# Altium schematic sheet Controler.SchDoc
size 203 x 177 mm
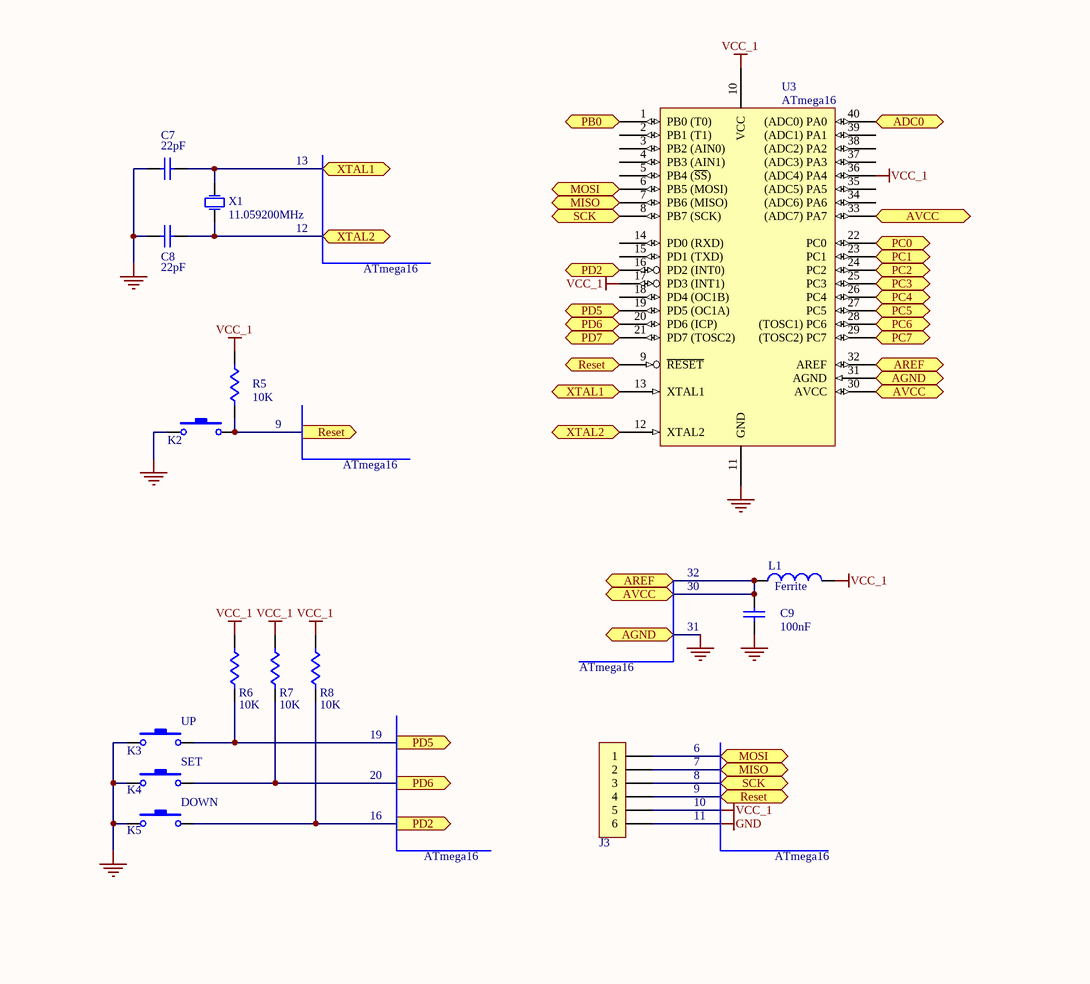
[diagram p0: Controler.SchDoc]

## Parts
C7  value 22pF  [RAD_5.08MM]  (hidden comment: Capacitor_2)
C8  value 22pF  [RAD_5.08MM]  (hidden comment: Capacitor_2)
C9  value 100nF  [RAD_5.08MM]  (hidden comment: Capacitor_2)
J3  Connector_6pin  [HDR1X6]  (value not drawn)
K2  SW-PB  [SPST-2]  (value not drawn)
K3  SW-PB  [SPST-2]  (value not drawn)
K4  SW-PB  [SPST-2]  (value not drawn)
K5  SW-PB  [SPST-2]  (value not drawn)
L1  Ferrite  [Inductor_1]
R5  value 10K  [AXIAL0.4]  (hidden comment: Resistor)
R6  value 10K  [AXIAL0.4]  (hidden comment: Resistor)
R7  value 10K  [AXIAL0.4]  (hidden comment: Resistor)
R8  value 10K  [AXIAL0.4]  (hidden comment: Resistor)
U3  Device: ATmega16  [DIP-40]  (hidden comment: ATmega16_DIP40)
X1  value 11.059200MHz  [XTAL_1]  (hidden comment: XTAL)

## Ports
ADC0, AGND, AREF, AVCC, MISO, MOSI, PB0, PC0, PC1, PC2, PC3, PC4, PC5, PC6, PC7, PD2, PD2 (out), PD5, PD5 (out), PD6, PD6 (out), PD7, Reset, Reset (out), SCK, XTAL1, XTAL2

## Nets
GND: C7.1 C8.1 C9.1 J3.6 K2.1 K3.1 K4.1 K5.1 U3.11(GND) U3.31(AGND) ; port AGND
VCC_1: J3.5 L1.2 R5.1 R6.1 R7.1 R8.1 U3.10(VCC) U3.17(PD3_(INT1)) U3.36((ADC4)_PA4)
ADC0: U3.40((ADC0)_PA0) ; port ADC0
AREF: C9.2 L1.1 U3.30(AVCC) U3.32(AREF) U3.33((ADC7)_PA7) ; port AREF, port AVCC
MISO: J3.2 U3.7(PB6_(MISO)) ; port MISO
MOSI: J3.1 U3.6(PB5_(MOSI)) ; port MOSI
PB0: U3.1(PB0_(T0)) ; port PB0
PC0: U3.22(PC0) ; port PC0
PC1: U3.23(PC1) ; port PC1
PC2: U3.24(PC2) ; port PC2
PC3: U3.25(PC3) ; port PC3
PC4: U3.26(PC4) ; port PC4
PC5: U3.27(PC5) ; port PC5
PC6: U3.28((TOSC1)_PC6) ; port PC6
PC7: U3.29((TOSC2)_PC7) ; port PC7
PD2: K5.2 R8.2 U3.16(PD2_(INT0)) ; port PD2
PD5: K3.2 R6.2 U3.19(PD5_(OC1A)) ; port PD5
PD6: K4.2 R7.2 U3.20(PD6_(ICP)) ; port PD6
PD7: U3.21(PD7_(TOSC2)) ; port PD7
Reset: J3.4 K2.2 R5.2 U3.9(~{RESET}) ; port Reset
SCK: J3.3 U3.8(PB7_(SCK)) ; port SCK
XTAL1: C7.2 U3.13(XTAL1) X1.2(OSC2) ; port XTAL1
XTAL2: C8.2 U3.12(XTAL2) X1.1(OSC1) ; port XTAL2

Not connected (* = marked no-connect by the designer): U3 2(PB1_(T1)) 3(PB2_(AIN0)) 4(PB3_(AIN1)) 5(PB4_(~{SS})) 14(PD0_(RXD)) 15(PD1_(TXD)) 18(PD4_(OC1B)) 34((ADC6)_PA6) 35((ADC5)_PA5) 37((ADC3)_PA3) 38((ADC2)_PA2) 39((ADC1)_PA1)

## Notes on the sheet
- 13
- 12
- ATmega16
- 9
- 32
- 30
- 31
- (near K3) UP
- 19
- SET
- 20
- 6
- 7
- 8
- DOWN
- 16
- 10
- 11

## Library data of the parts
C7-C9 = Capacitor_2: Capacitor; Manufacturer: Generic Components; Class I: Passive; Published: 8-Jun-2000; Revision: July-2002: Re-released for DXP Platform.; Publisher: Altium Limited; Class II: Capacitor
J3 = Connector_6pin: Header, 6-Pin; Manufacturer: Generic Components; Revision: July-2002: Re-released for DXP Platform.; Publisher: Altium Limited; Class I: Connector
K2 = SW-PB: Switch; Manufacturer: Generic Components; Published: 24-Mar-1999; Revision: July-2002: Re-released for DXP Platform.; Publisher: Altium Limited
K3-K5 = SW-PB: Switch, Key; Manufacturer: Generic Components; Published: 24-Mar-1999; Revision: July-2002: Re-released for DXP Platform.; Publisher: Altium Limited
L1 = Inductor: Manufacturer: Generic Components; Class I: Passive; Published: 8-Jun-2000; Revision: July-2002: Re-released for DXP Platform.; Publisher: Altium Limited; Class II: Ferrite
R5-R8 = Resistor: Manufacturer: Generic Components; Revision: July-2002: Re-released for DXP Platform.; Publisher: Altium Limited
U3 = ATmega16_DIP40: Atmel Microcontroller - Library created by carel..  <www.mpfreezone.com>
X1 = XTAL: Crystal Oscillator; Manufacturer: Generic Components; Published: 8-Jun-2000; Revision: July-2002: Re-released for DXP Platform.; Publisher: Altium Limited; Class I: Oscillator; Class II: Crystal Oscillator